# EasyEDA Pro project FSS1500-HANDv2.0.eprj

# Schematic Schematic1
Create Date: 2022-12-30; Page Name: P1; Project Name: FSS1500-HAND; Schematic Name: Schematic1; Update Date: 2023-02-28
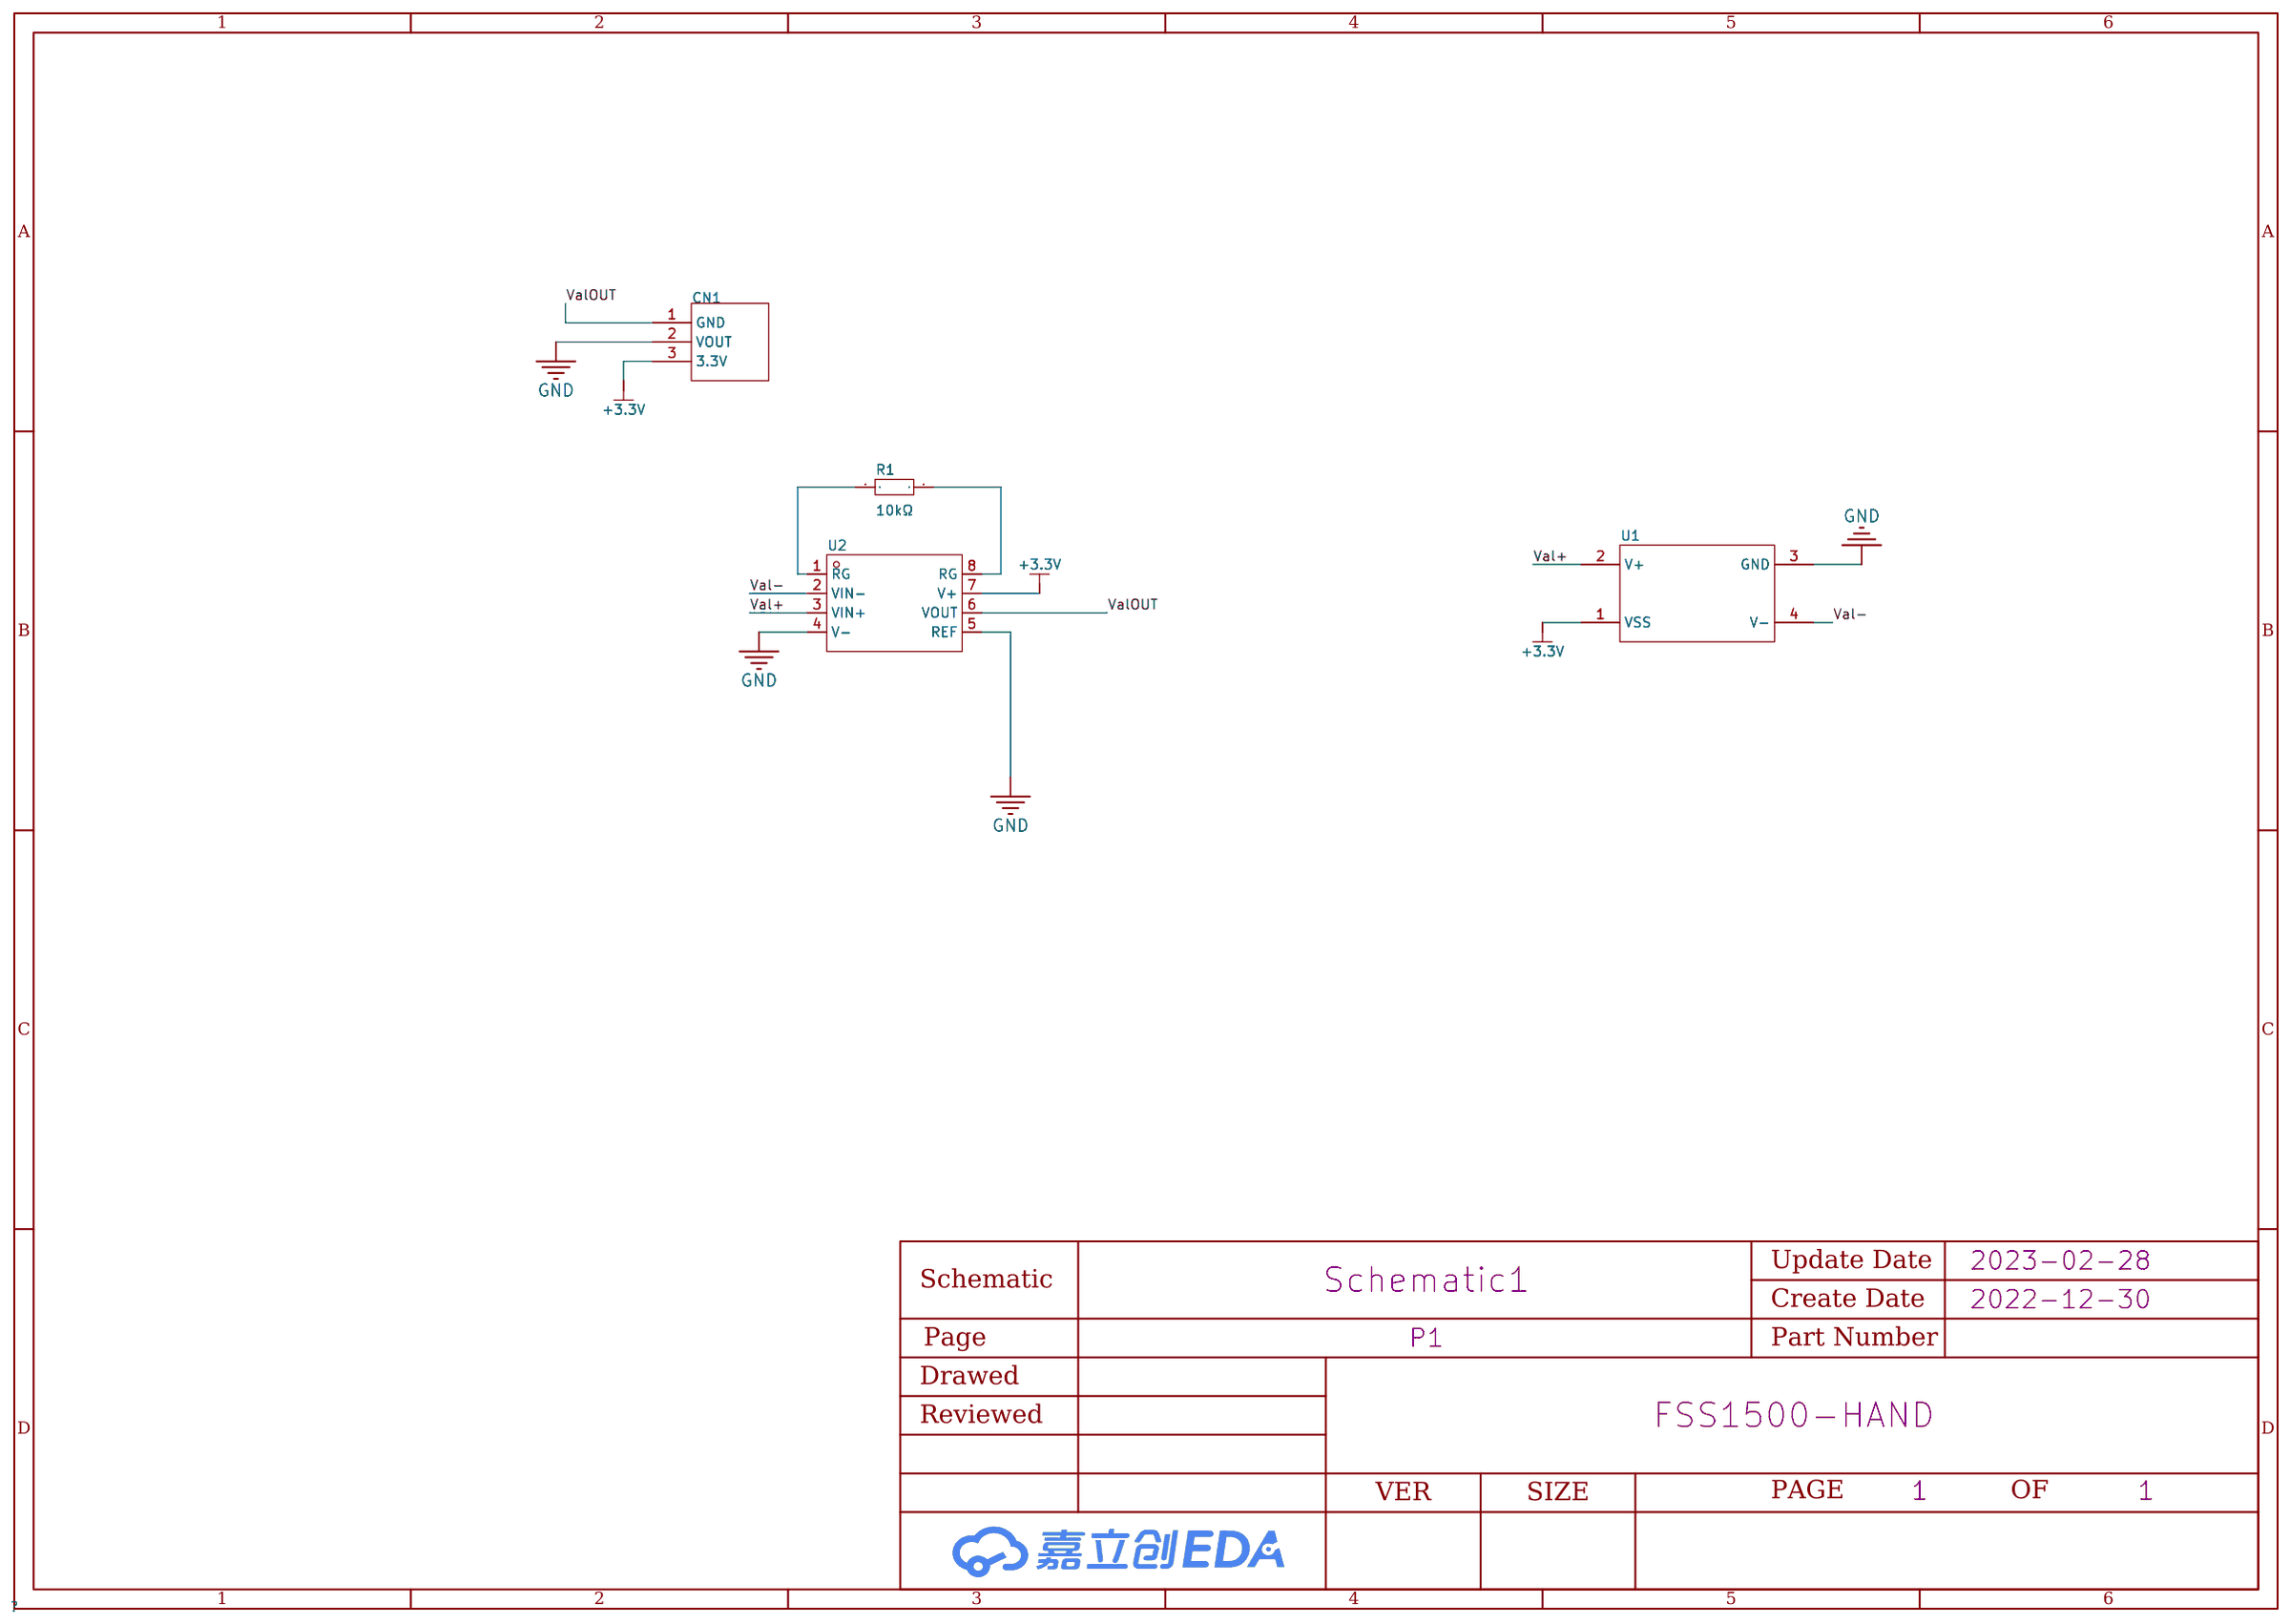
[diagram p0: schematic sheet]

## Parts
CN1  -  [3POINT]
R1  10kΩ  [R0603]
U1  -  [FSS1500NST]
U2  INA333AIDGKR  [MSOP-8_L3.0-W3.0-P0.65-LS5.0-BL]

## Library data of the parts
CN1 = 3POINT
R1 = CR0603JA0103G: 电阻类型:厚膜电阻;阻值:10kΩ;精度:±5%;功率:1/10W;温度系数:±200ppm/;最大工作电压:50V;工作温度范围:-55~+125;; LCSC Part Name: 10kΩ ±5%; Supplier Part: C101254; Manufacturer: LIZ(丽智电子); Supplier Footprint: 0603; JLCPCB Part Class: Extended Part; Datasheet: https://atta.szlcsc.com/upload/public/pdf/source/20170408/1491631441449.pdf; Supplier: LCSC; Type: 厚膜电阻; Tolerance: ±5%; Power(Watts): 1/10W; Temperature Coefficient: ±200ppm/; Overload Voltage (Max): 50V; Operating Temperature Range: -55~+125
U1 = FSS1500
U2 = INA333AIDGKR: 运放类型:Instrumentation;放大器组数:1;增益带宽积（GBP）:-;压摆率（SR）:0.16 V/us;电源电压:1.8V ~ 5.5V, ±0.9V ~ 2.75V;各通道供电电流:75uA;; Supplier Part: C19450; Manufacturer: TI(德州仪器); Supplier Footprint: VSSOP-8; JLCPCB Part Class: Extended Part; Datasheet: https://atta.szlcsc.com/upload/public/pdf/source/20130925/1457706651096.pdf; Supplier: LCSC; Amplifier Type: Instrumentation; Number of Circuits: 1; Slew Rate（SR）: 0.16 V/us; Output Type: Rail-to-Rail; Supply Voltage（Single）: 1.8V ~ 5.5V, ±0.9V ~ 2.75V; Iq per channel (Typ): 75uA; Operating Temperature: -40°C ~ 125°C

## Nets
+3.3V: CN1.3(3.3V) U1.1(VSS) U2.7(V+)
GND: CN1.2(VOUT) U1.3(GND) U2.4(V-) U2.5(REF)
Val+: U1.2(V+) U2.3(VIN+)
Val-: U1.4(V-) U2.2(VIN-)
ValOUT: CN1.1(GND) U2.6(VOUT)
$1N427: R1.1 U2.1(RG)
$1N434: R1.2 U2.8(RG)

# Board PCB1
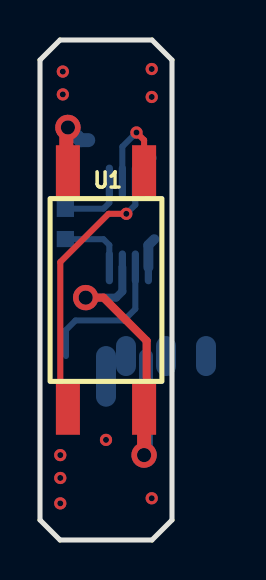
[diagram p1: board, top side]
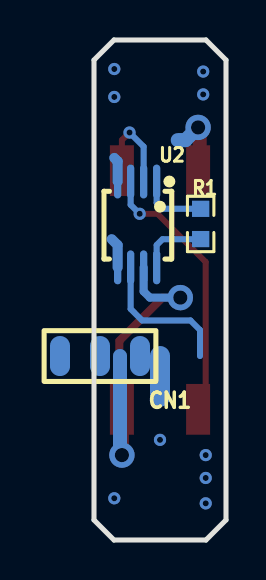
[diagram p2: board, bottom side, seen from below]

Outline 6.6 x 25 mm; copper layers: Top Layer, Bottom Layer. Coordinates in mm from the lower left corner of the outline.
Outline path: 0,24 0,1 1,0 5.6,0 6.6,1 6.6,24 5.6,25 1,25 0,24
Stack: Top Layer 0.035mm / Dielectric1 1.51mm FR4 er 4.5 / Bottom Layer 0.035mm

## Design rules (mm)
spacing safeClearance (default): track to track 0.152, other pairs 0.152 to 0.3
track width trackWidth (default): min 0.127, default 0.254, max 2.54
differential pair differentialPair (default): width min 0.127, default 0.254, max 2.54; gap min 0.152, default 0.152
via viaSize (default): diameter min 0.5, default 0.61, max 10; hole min 0.3, default 0.305, max 6

## Placement (name value [footprint] x y rotation side)
CN1  -  [3POINT]  3.3 9.2 0 bottom
R1  10kΩ  [R0603]  1.27 15.8 270 bottom
U1  -  [FSS1500NST]  3.3 12.5 90 top
U2  INA333AIDGKR  [MSOP-8_L3.0-W3.0-P0.65-LS5.0-BL]  4.44 15.78 0 bottom

## Footprints (pads in the part's own frame, mm; a bottom-side part is the same pattern mirrored in y, then rotated)
3POINT
  oval 1x2 smd: 1(1,0) 2(3,0) 3(5,0)
FSS1500NST
  rect 2.54x1.2 smd: 1(-5.967,-1.905) 2(-5.967,1.905) 3(5.967,1.905) 4(5.967,-1.905)
MSOP-8_L3.0-W3.0-P0.65-LS5.0-BL
  oval 0.363x1.692 smd: 1(-0.976,-2.147) 2(-0.325,-2.147) 3(0.325,-2.147) 4(0.976,-2.147) 5(0.976,2.147) 6(0.325,2.147) 7(-0.325,2.147) 8(-0.976,2.147)
R0603
  rect 0.807x0.864 smd: 1(-0.754,0) 2(0.754,0)

## Nets
+3.3V: CN1.3 U1.1 U2.7
GND: CN1.2 U1.3 U2.4 U2.5
VAL+: U1.2 U2.3
VAL-: U1.4 U2.2
VALOUT: CN1.1 U2.6
$1N427: R1.1 U2.1
$1N434: R1.2 U2.8

## Via types
v1: diameter 0.61, hole 0.305, Top Layer to Bottom Layer, 11 vias
v2: diameter 1.27, hole 0.711, Top Layer to Bottom Layer, 3 vias

## Routing (per net, layer and track width the routed paths; a pad name or vN(x,y) marks a point on that pad's centre or on a via; arc(x,y) is an arc through that point)
+3.3V: length 17.9
  Top Layer w0.4: v2(2.28,12.12) 3.17,12.12 5.33,9.96 5.33,6.66 U1.1
  Top Layer w0.7: v2(5.21,4.25) U1.1
  Bottom Layer w0.4: v2(2.28,12.12) 3.81,12.12 4.12,12.43 U2.7
  Bottom Layer w0.7: 5.3,9.2 5.3,4.34 v2(5.21,4.25)
GND: length 8.3
  Top Layer w0.7: U1.3 1.31,18.55 1.31,20.55 v2(1.4,20.63)
  Bottom Layer w0.5: 5.71,15.04 5.42,14.75 U2.5 ; 5.59,19.1 5.42,18.94 U2.4
  Bottom Layer w0.7: v2(1.4,20.63) 2.03,19.99 2.41,19.99
  Bottom Layer w1: 3.3,9.2 3.3,7.17
  vias: v1(1.01,4.25) v1(1.01,3.1) v1(1.01,1.83) v1(1.14,23.42) v1(1.14,22.28) v1(3.3,5.01) v1(5.59,23.55) v1(5.59,22.15) v1(5.59,2.09)
VAL+: length 13.6
  Top Layer w0.3: U1.2 1.01,6.91 1.01,13.9 3.43,16.31 v1(4.32,16.31)
  Bottom Layer w0.3: v1(4.32,16.31) 4.77,16.76 U2.3
VAL-: length 5.2
  Top Layer w0.3: 5.46,18.21 U1.4 5.21,19.99 v1(4.82,20.37)
  Bottom Layer w0.3: v1(4.82,20.37) 4.12,19.67 U2.2
VALOUT: length 7.3
  Bottom Layer w0.3: 1.3,9.2 1.3,10.5 1.78,10.98 4.19,10.98 4.77,11.56 U2.6
$1N427: length 3.4
  Bottom Layer w0.3: U2.1 3.47,16.86 3.17,16.56 1.28,16.56 R1.1
$1N434: length 3.4
  Bottom Layer w0.3: U2.8 3.47,14.75 3.17,15.04 1.28,15.04 R1.2

## Copper pours and planes (outline as drawn; the poured copper is in the pictures)
GND on Top Layer: -0.76,25.71 7.36,25.71 7.36,-0.58 -0.76,-0.58
GND on Bottom Layer: -0.76,25.71 7.36,25.71 7.36,-0.58 -0.76,-0.58
